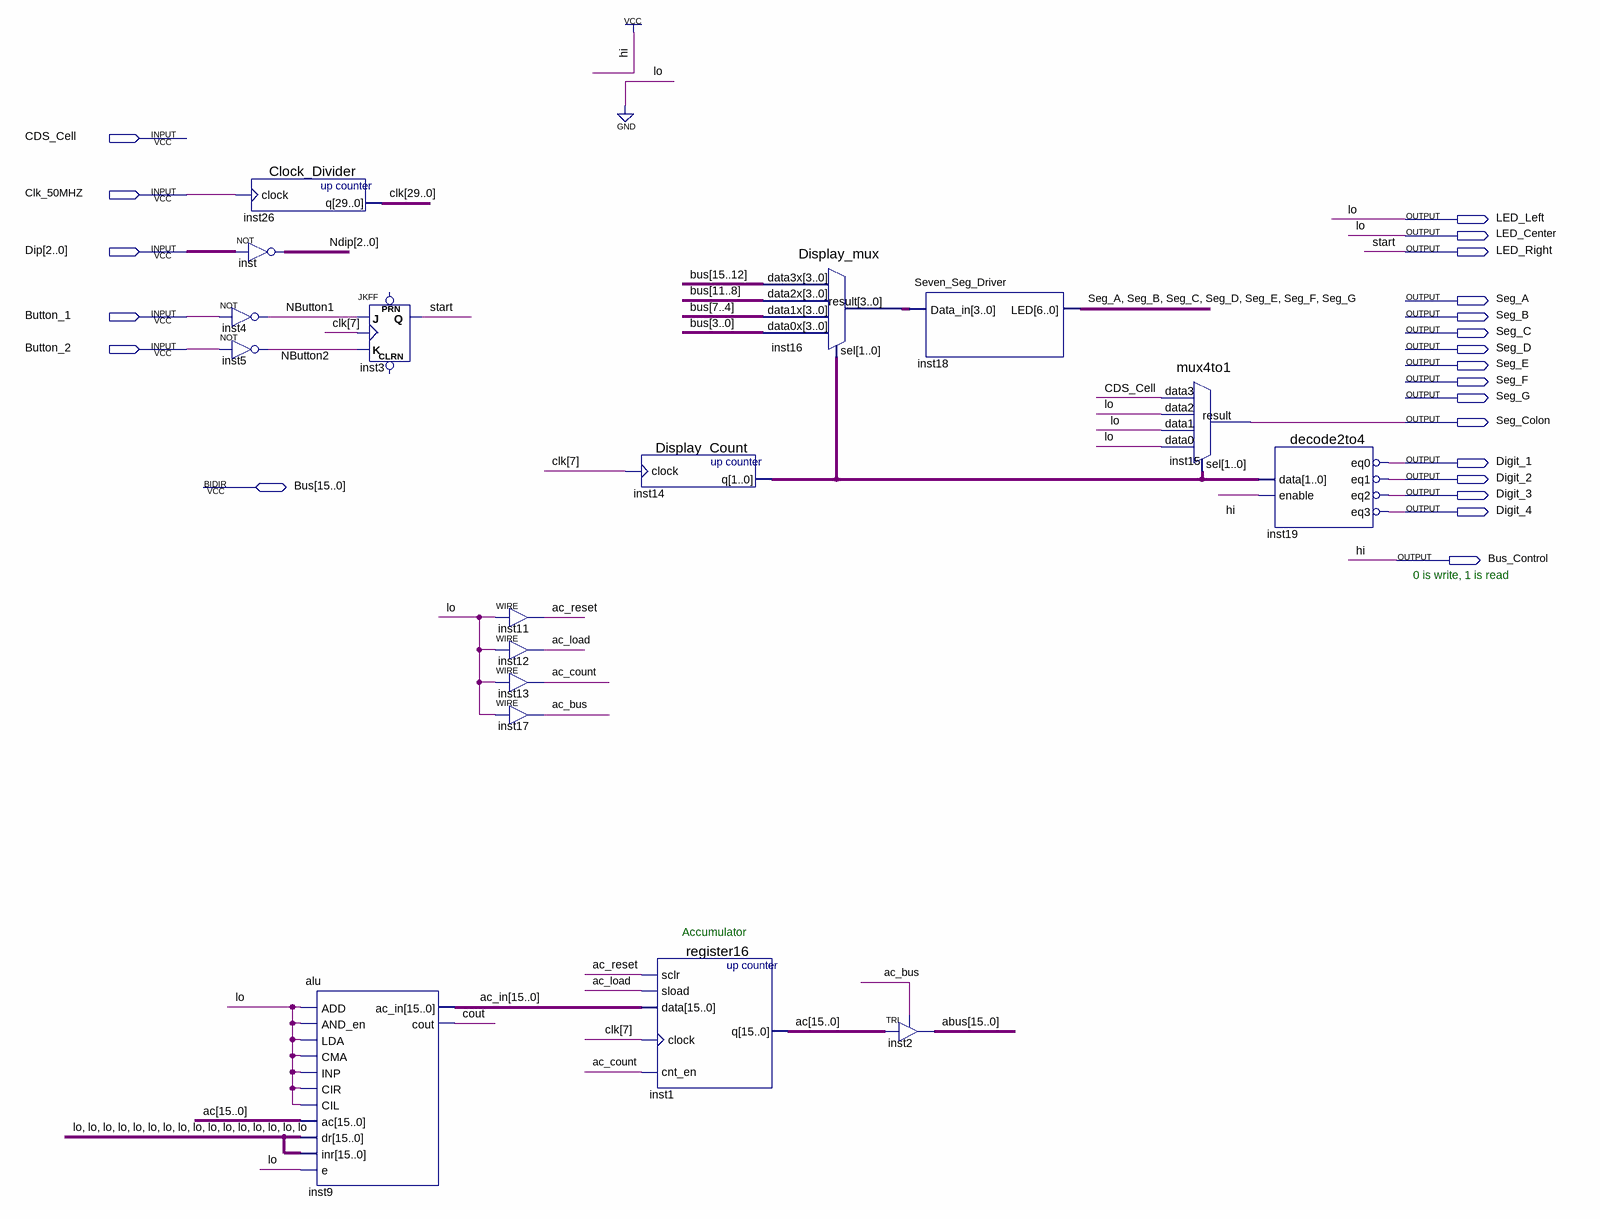
[diagram p0: schematic sheet]
// Quartus schematic Mino_Machine.bdf as structural Verilog: 17 symbols, 22 pins
module Mino_Machine (
  input  CDS_Cell,
  input  Clk_50MHZ,
  input  [2:0] Dip,
  input  Button_1,
  input  Button_2,
  inout  [15:0] Bus,
  output LED_Left,
  output LED_Center,
  output LED_Right,
  output Seg_A,
  output Seg_B,
  output Seg_C,
  output Seg_D,
  output Seg_E,
  output Seg_F,
  output Seg_G,
  output Seg_Colon,
  output Digit_1,
  output Digit_2,
  output Digit_3,
  output Digit_4,
  output Bus_Control
);

  wire ac_bus, ac_count, ac_load, ac_reset, cout, inst19_eq0, inst19_eq1, inst19_eq2, inst19_eq3, NButton1,
       NButton2;
  wire [1:0] inst14_q;
  wire [2:0] Ndip;
  wire [3:0] inst16_result;
  wire [15:0] abus, ac, ac_in;
  wire [29:0] clk;

  Clock_Divider inst26 (.clock(Clk_50MHZ), .q(clk));
  assign Ndip = ~Dip;  // NOT inst, 3 bits wide
  not inst4 (NButton1, Button_1);
  not inst5 (NButton2, Button_2);
  alu inst9 (
    .ADD(1'b0), .AND_en(1'b0), .LDA(1'b0), .CMA(1'b0), .INP(1'b0), .CIR(1'b0), .CIL(1'b0), .ac(ac),
    .dr({16{1'b0}}), .inr({16{1'b0}}), .e(1'b0), .ac_in(ac_in), .cout(cout));
  JKFF inst3 (.K(NButton2), .J(NButton1), .CLK(clk[7]), .Q(LED_Right));  // open: PRN, CLRN
  assign ac_reset = 1'b0;  // WIRE inst11
  assign ac_load = 1'b0;  // WIRE inst12
  assign ac_count = 1'b0;  // WIRE inst13
  assign ac_bus = 1'b0;  // WIRE inst17
  Display_Count inst14 (.clock(clk[7]), .q(inst14_q));
  register16 inst1 (.sclr(ac_reset), .sload(ac_load), .data(ac_in), .clock(clk[7]), .cnt_en(ac_count), .q(ac));
  Display_mux inst16 (
    .data3x(Bus[15:12]), .data2x(Bus[11:8]), .data1x(Bus[7:4]), .data0x(Bus[3:0]), .sel(inst14_q),
    .result(inst16_result));
  TRI inst2[15:0] (.IN(ac), .OE(ac_bus), .OUT(abus));
  Seven_Seg_Driver inst18 (.Data_in(inst16_result), .LED({Seg_A, Seg_B, Seg_C, Seg_D, Seg_E, Seg_F, Seg_G}));
  mux4to1 inst15 (.data3(CDS_Cell), .data2(1'b0), .data1(1'b0), .data0(1'b0), .sel(inst14_q), .result(Seg_Colon));
  decode2to4 inst19 (
    .data(inst14_q), .enable(1'b1), .eq0(inst19_eq0), .eq1(inst19_eq1), .eq2(inst19_eq2), .eq3(inst19_eq3));
  not inst19_eq0_inverted (Digit_1, inst19_eq0);
  not inst19_eq1_inverted (Digit_2, inst19_eq1);
  not inst19_eq2_inverted (Digit_3, inst19_eq2);
  not inst19_eq3_inverted (Digit_4, inst19_eq3);

  assign Bus_Control = 1'b1;
  assign LED_Center = 1'b0;
  assign LED_Left = 1'b0;

  // Other names for the same wires on the sheet: start = LED_Right

  // Notes on the sheet:
  //   0 is write, 1 is read
  //   Accumulator
endmodule
